# EAGLE design phasor (EAGLE 6.6.0)
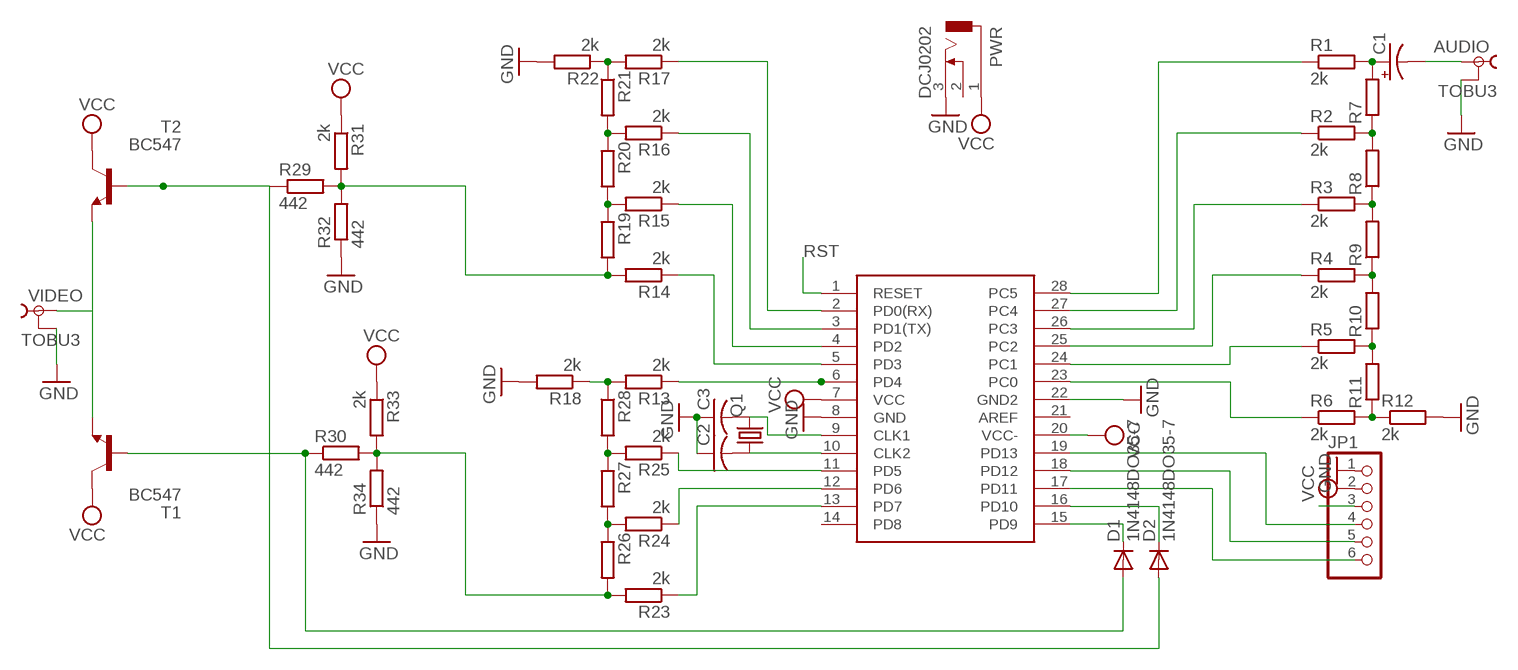
[diagram p0: schematic, sheet 1]

## Parts
AUDIO  TOBU3  [TOBU3]
C1  CPOL-USB45181A  [B45181A]
C2  C-US025-024X044  [C025-024X044]
C3  C-US025-024X044  [C025-024X044]
D1  1N4148DO35-7  [DO35-7]
D2  1N4148DO35-7  [DO35-7]
JP1  PINHD-1X6  [1X06]
PWR  DCJ0202  [DCJ0202]
Q1  CRYSTALHC49U70  [HC49U70]
R1  2k  R-EU_0207/10  [0207/10]
R2  2k  R-EU_0207/10  [0207/10]
R3  2k  R-EU_0207/10  [0207/10]
R4  2k  R-EU_0207/10  [0207/10]
R5  2k  R-EU_0207/10  [0207/10]
R6  2k  R-EU_0207/10  [0207/10]
R7  R-EU_0204/2V  [0204V]
R8  R-EU_0204/2V  [0204V]
R9  R-EU_0204/2V  [0204V]
R10  R-EU_0204/2V  [0204V]
R11  R-EU_0204/2V  [0204V]
R12  2k  R-EU_0207/10  [0207/10]
R13  2k  R-EU_0207/10  [0207/10]
R14  2k  R-EU_0207/10  [0207/10]
R15  2k  R-EU_0207/10  [0207/10]
R16  2k  R-EU_0207/10  [0207/10]
R17  2k  R-EU_0207/10  [0207/10]
R18  2k  R-EU_0207/10  [0207/10]
R19  R-EU_0204/2V  [0204V]
R20  R-EU_0204/2V  [0204V]
R21  R-EU_0204/2V  [0204V]
R22  2k  R-EU_0207/10  [0207/10]
R23  2k  R-EU_0207/10  [0207/10]
R24  2k  R-EU_0207/10  [0207/10]
R25  2k  R-EU_0207/10  [0207/10]
R26  R-EU_0204/2V  [0204V]
R27  R-EU_0204/2V  [0204V]
R28  R-EU_0204/2V  [0204V]
R29  442  R-EU_0204/5  [0204/5]
R30  442  R-EU_0204/2V  [0204V]
R31  2k  R-EU_0207/10  [0207/10]
R32  442  R-EU_0204/2V  [0204V]
R33  2k  R-EU_0207/10  [0207/10]
R34  442  R-EU_0204/2V  [0204V]
T1  BC547  [TO92]
T2  BC547  [TO92]
U$1  328P  [DIL28-3]
VIDEO  TOBU3  [TOBU3]

## Nets
GND: AUDIO.2 AUDIO.2@1 AUDIO.2@2 C2.1 C3.1 JP1.1 PWR.3 R12.2 R18.2 R22.2 R32.1 R34.1 U$1.8(GND) U$1.22(GND2) VIDEO.2 VIDEO.2@1 VIDEO.2@2
N$1: R1.1 U$1.28(PC5)
N$2: R2.1 U$1.27(PC4)
N$3: R3.1 U$1.26(PC3)
N$4: R4.1 U$1.25(PC2)
N$5: R5.1 U$1.24(PC1)
N$6: R6.1 U$1.23(PC0)
N$7: C1.+ R1.2 R7.2
N$8: R2.2 R7.1 R8.2
N$9: R3.2 R8.1 R9.2
N$10: R4.2 R9.1 R10.2
N$11: R5.2 R10.1 R11.2
N$12: R6.2 R11.1 R12.1
N$13: R17.1 U$1.2(PD0(RX))
N$14: R16.1 U$1.3(PD1(TX))
N$15: R15.1 U$1.4(PD2)
N$16: R14.1 U$1.5(PD3)
N$17: R13.1 U$1.6(PD4)
N$18: R13.2 R18.1 R28.1
N$19: R14.2 R19.2 R29.2 R31.2 R32.2
N$20: R15.2 R19.1 R20.2
N$21: R16.2 R20.1 R21.2
N$22: R17.2 R21.1 R22.1
N$23: R23.2 R26.2 R30.2 R33.2 R34.2
N$24: R24.2 R26.1 R27.2
N$25: R25.2 R27.1 R28.2
N$26: R25.1 U$1.11(PD5)
N$27: R24.1 U$1.12(PD6)
N$28: R23.1 U$1.13(PD7)
N$29: C2.2 Q1.1 U$1.10(CLK2)
N$30: C3.2 Q1.2 U$1.9(CLK1)
N$31: AUDIO.1 C1.-
N$32: D1.C U$1.15(PD9)
N$33: D2.C U$1.16(PD10)
N$34: T1.1(E) T2.1(E) VIDEO.1
N$35: D1.A R30.1 T1.2(B)
N$36: D2.A R29.1 T2.2(B)
N$37: JP1.4 U$1.19(PD13)
N$38: JP1.5 U$1.18(PD12)
N$39: JP1.6 U$1.17(PD11)
RST: JP1.3 U$1.1(RESET)
VCC: JP1.2 PWR.1 R31.1 R33.1 T1.3(C) T2.3(C) U$1.7(VCC) U$1.20(VCC-)
Unconnected: PWR.2 U$1.14(PD8) U$1.21(AREF)

## Library data of the parts
AUDIO VIDEO = con-hirschmann:TOBU3: Female Cinch CONNECTOR ( RCA Jack ); MF: FARNELL; MPN: TOBU 3; OC_FARNELL: 592791; OC_NEWARK: 06WX5914
C1 = resistor:CPOL-US: POLARIZED CAPACITOR, American symbol
C2 C3 = resistor:C-US: CAPACITOR, American symbol
D1 D2 = diode:1N4148: DIODE high speed (Philips)
JP1 = pinhead:PINHD-1X6: PIN HEADER
PWR = con-jack:DCJ0202: DC POWER JACK Source: DCJ0202.pdf; OC_FARNELL: unknown; OC_NEWARK: unknown
Q1 = crystal:CRYSTAL: CRYSTAL; OC_FARNELL: unknown; OC_NEWARK: unknown
R1-R34 = resistor:R-EU_: RESISTOR, European symbol
T1 T2 = transistor:BC547: NPN TRANSISTOR
U$1 = 328pp:328P

## Board
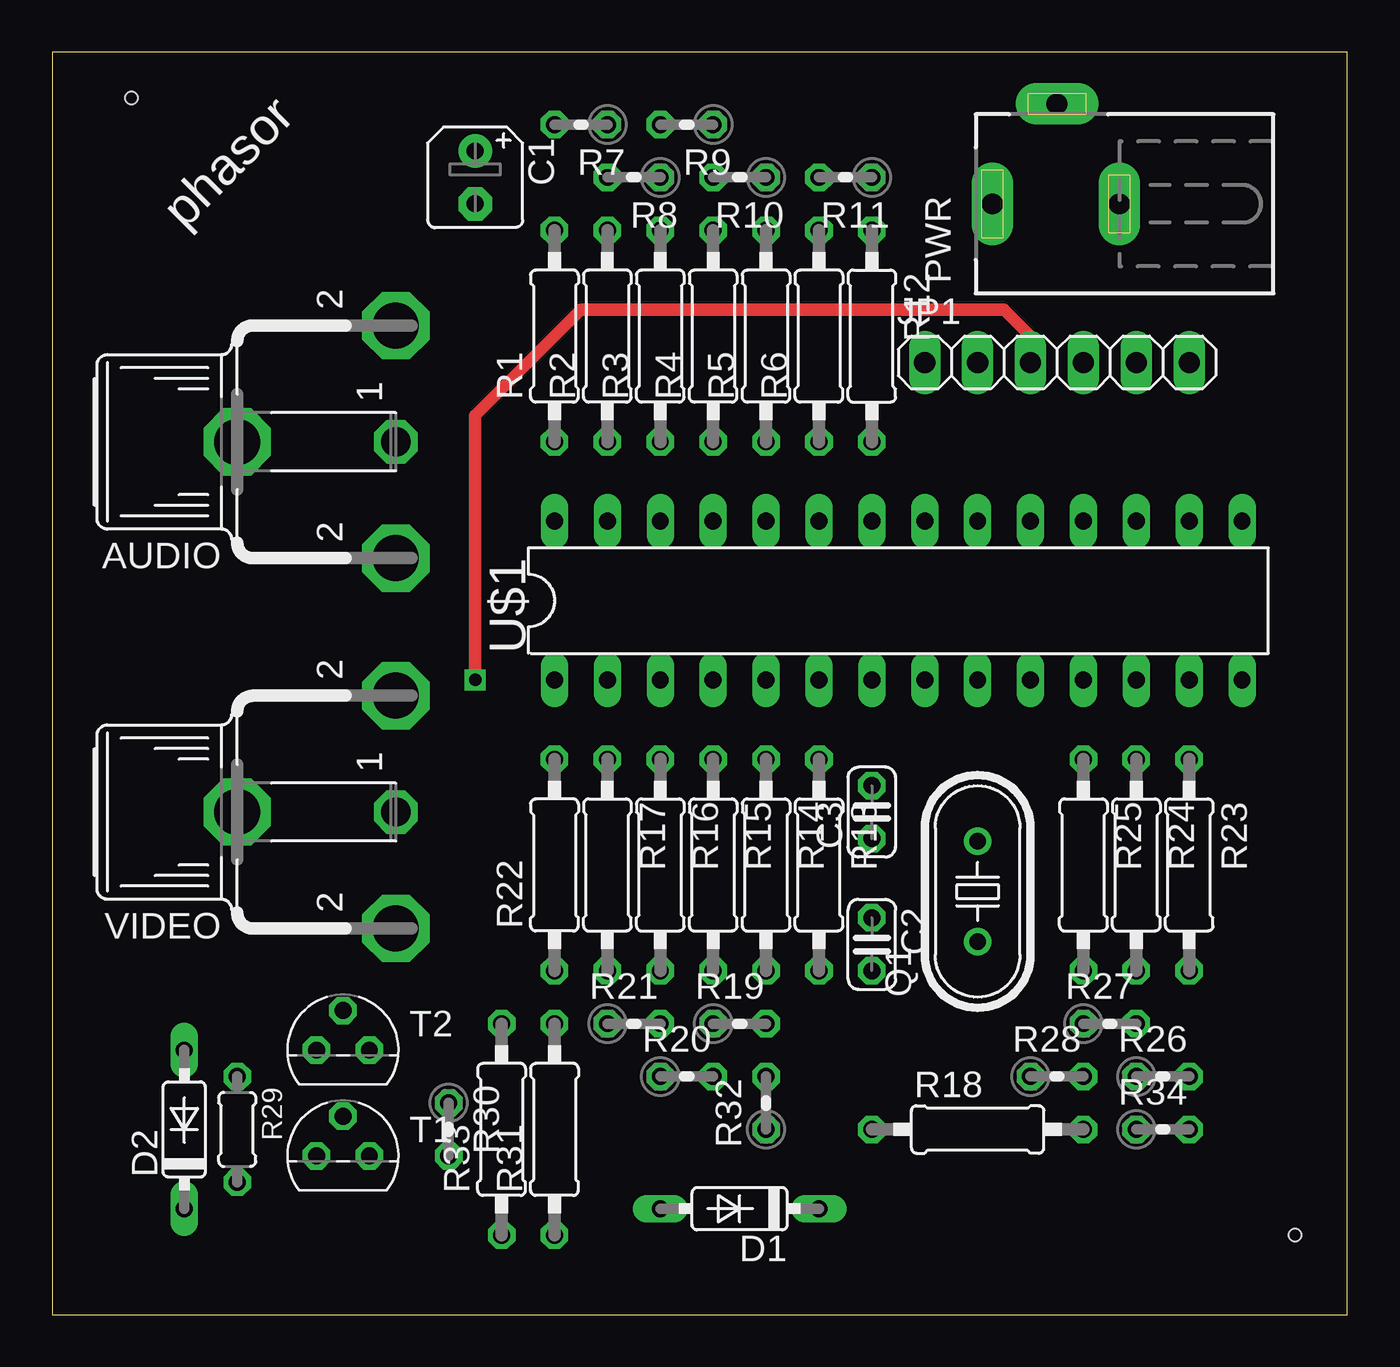
[diagram p1: board, top side]
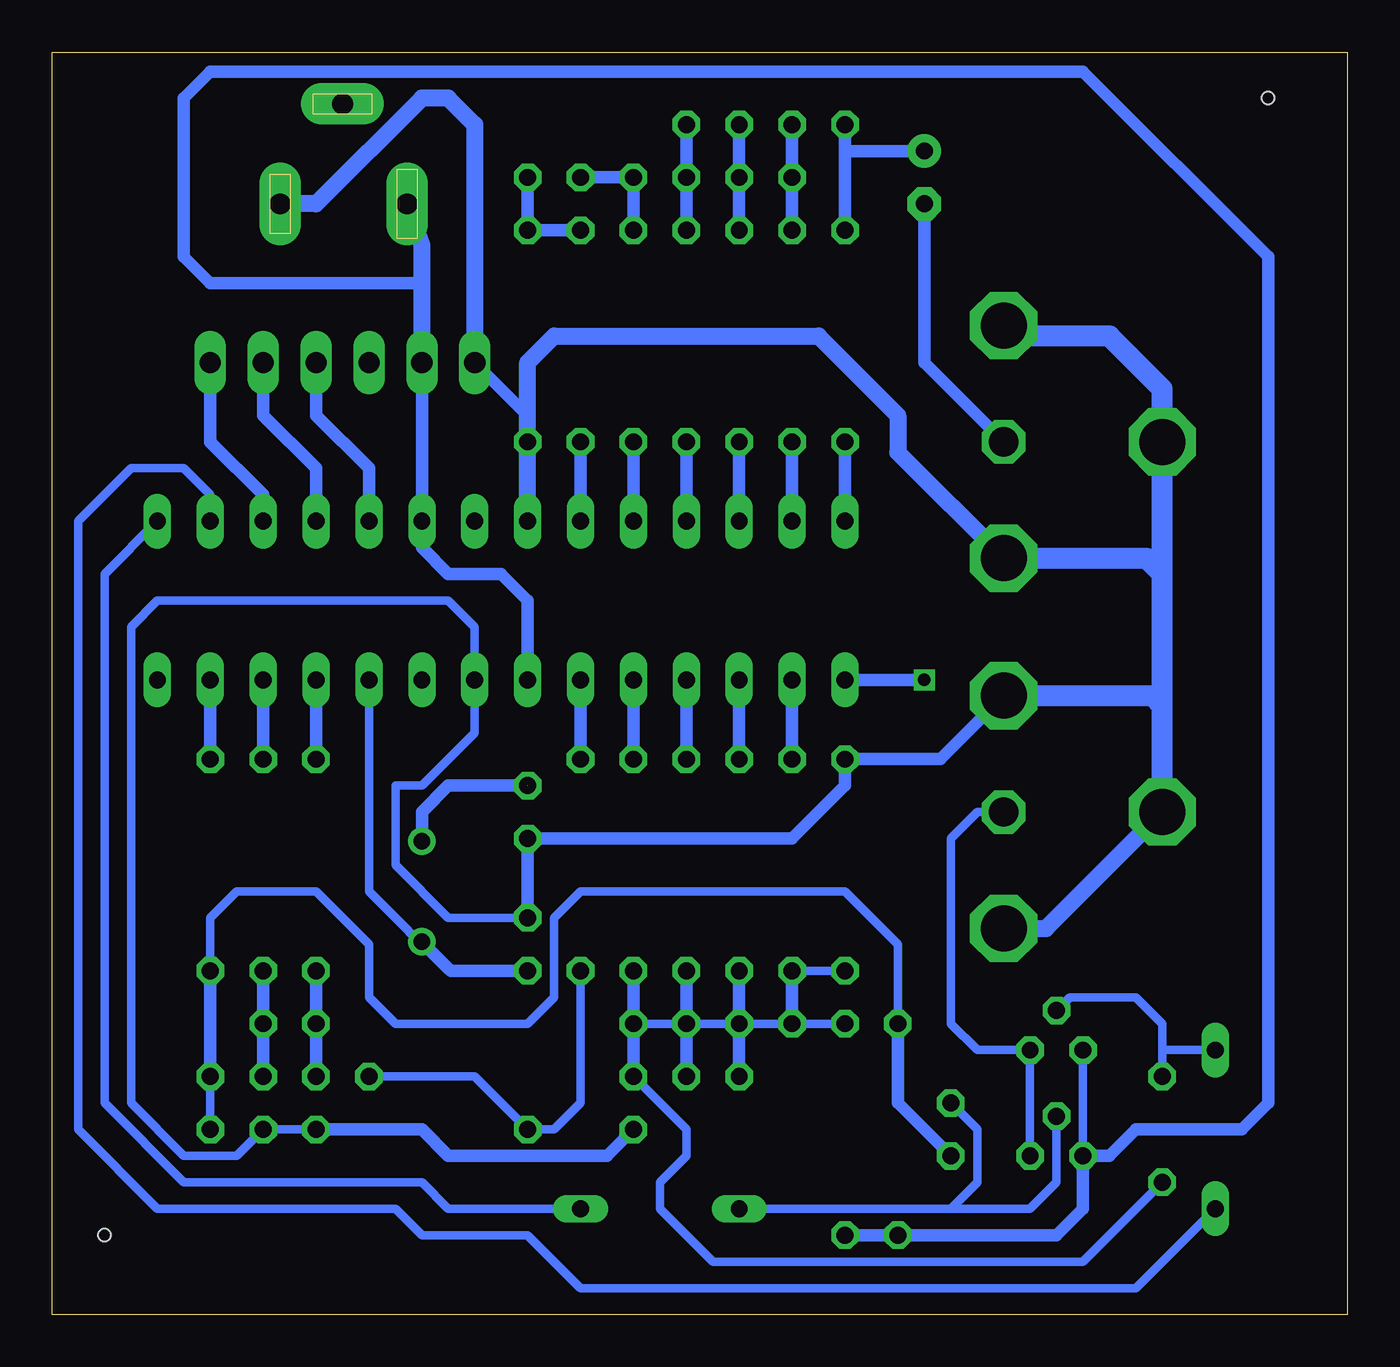
[diagram p2: board, bottom side, seen from below]

Size 62.21 x 60.63 mm. Coordinates in mm from the lower left corner, seen from the top.
Outline: 0,0 62.21,0 62.21,60.63 0,60.63 0,0
Copper layers (1*16): Top 0.035mm / dielectric 1.5mm / Bottom 0.035mm
Design rules "default": minimum track width 10mil, minimum drill 24mil, track to track 8mil, track to pad 8mil, pad to pad 8mil, via to via 8mil, smd to smd 8mil, copper to edge 40mil, drill to drill 8mil, minimum pad ring 10mil, minimum via ring 8mil, stop-mask expansion 4mil, vias tented up to drill 0mil, thermal gap 10mil
Holes 0.6 mm at 3.81,58.42 59.69,3.81

### Footprints (pad centres in the part's own frame; a part is rotated, then mirrored left to right if it is on the bottom)
TOBU3 = drill 1.397 octagon: 1 0,-2.54 | drill 2.21 octagon: 2 5.588,-2.54; 2@1 -5.588,-2.54; 2@2 0,5.08
B45181A = drill 0.813 pad 1.6: + -1.27,0 | drill 0.813 pad 1.6 octagon: - 1.27,0
C025-024X044 = drill 0.813 octagon: 1 -1.27,0; 2 1.27,0
DO35-7 = drill 0.813 long: A 3.81,0; C -3.81,0
1X06 = drill 1.016 long: 1 -6.35,0; 2 -3.81,0; 3 -1.27,0; 4 1.27,0; 5 3.81,0; 6 6.35,0
DCJ0202 = drill 1 pad 2 long: 1 0,3.1; 2 4.8,0; 3 0,-3
HC49U70 = drill 0.813: 1 -2.413,0; 2 2.413,0
0207/10 = drill 0.813 octagon: 1 -5.08,0; 2 5.08,0
0204V = drill 0.813 octagon: 1 -1.27,0; 2 1.27,0
0204/5 = drill 0.813 octagon: 1 -2.54,0; 2 2.54,0
TO92 = drill 0.813 octagon: 1 1.27,0; 2 0,1.905; 3 -1.27,0
DIL28-3 = drill 0.813 long: 1 -16.51,-3.81; 2 -13.97,-3.81; 3 -11.43,-3.81; 4 -8.89,-3.81; 5 -6.35,-3.81; 6 -3.81,-3.81; 7 -1.27,-3.81; 8 1.27,-3.81; 9 3.81,-3.81; 10 6.35,-3.81; 11 8.89,-3.81; 12 11.43,-3.81; 13 13.97,-3.81; 14 16.51,-3.81; 15 16.51,3.81; 16 13.97,3.81; 17 11.43,3.81; 18 8.89,3.81; 19 6.35,3.81; 20 3.81,3.81; 21 1.27,3.81; 22 -1.27,3.81; 23 -3.81,3.81; 24 -6.35,3.81; 25 -8.89,3.81; 26 -11.43,3.81; 27 -13.97,3.81; 28 -16.51,3.81

### Placement (x,y rotation side)
AUDIO  13.97,41.91 90 top
C1  20.32,54.61 270 top
C2  39.37,17.78 270 top
C3  39.37,24.13 90 top
D1  33.02,5.08 180 top
D2  6.35,8.89 90 top
JP1  48.26,45.72 0 top
PWR  48.26,53.34 90 top
Q1  44.45,20.32 90 top
R1  24.13,46.99 90 top
R2  26.67,46.99 90 top
R3  29.21,46.99 90 top
R4  31.75,46.99 90 top
R5  34.29,46.99 90 top
R6  36.83,46.99 90 top
R7  25.4,57.15 180 top
R8  27.94,54.61 180 top
R9  30.48,57.15 180 top
R10  33.02,54.61 180 top
R11  38.1,54.61 180 top
R12  39.37,46.99 270 top
R13  36.83,21.59 270 top
R14  34.29,21.59 270 top
R15  31.75,21.59 270 top
R16  29.21,21.59 270 top
R17  26.67,21.59 270 top
R18  44.45,8.89 0 top
R19  33.02,13.97 0 top
R20  30.48,11.43 0 top
R21  27.94,13.97 0 top
R22  24.13,21.59 90 top
R23  54.61,21.59 270 top
R24  52.07,21.59 270 top
R25  49.53,21.59 270 top
R26  53.34,11.43 0 top
R27  50.8,13.97 0 top
R28  48.26,11.43 0 top
R29  8.89,8.89 270 top
R30  19.05,8.89 270 top
R31  24.13,8.89 90 top
R32  34.29,10.16 90 top
R33  21.59,8.89 90 top
R34  53.34,8.89 0 top
T1  13.97,7.62 0 top
T2  13.97,12.7 0 top
U$1  40.64,34.29 0 top
VIDEO  13.97,24.13 90 top

### Tracks (layer width: path | path; a pad name or v marks a point on that pad's centre or on a via)
GND
  Bottom 0.406: C2.1 43.18,19.05 45.72,21.59 45.72,25.4 44.45,25.4 41.91,27.94 U$1.8 41.91,33.02 43.18,34.29 57.15,34.29 58.42,33.02 58.42,10.16 55.88,7.62 53.34,7.62 R34.1 R18.2
  Bottom 0.61: C2.1 C3.1 26.67,22.86 24.13,25.4 R22.2 19.56,26.67 VIDEO.2 | U$1.22 R12.2 39.37,43.18 JP1.1 | R18.2 44.45,8.89 43.18,7.62 35.56,7.62 R32.1
  Bottom 0.813: 50.8,53.34 PWR.3 49.53,53.34 44.45,58.42 43.18,58.42 41.91,57.15 JP1.1 | VIDEO.2@1 14.48,18.54 VIDEO.2@2 | U$1.22 39.37,45.72 38.1,46.99 25.4,46.99 21.59,43.18 21.59,41.4 AUDIO.2@1
  Bottom 1.016: VIDEO.2@2 8.89,29.21 | 8.89,29.21 8.89,35.56 | 8.89,35.56 AUDIO.2@2 8.89,44.45 11.43,46.99 16,46.99 AUDIO.2 | AUDIO.2@1 9.65,36.32 8.89,35.56 | VIDEO.2 9.4,29.72 8.89,29.21
N$1
  Bottom 0.61: U$1.28 R1.1
N$2
  Bottom 0.61: U$1.27 R2.1
N$3
  Bottom 0.61: U$1.26 R3.1
N$4
  Bottom 0.61: U$1.25 R4.1
N$5
  Bottom 0.61: U$1.24 R5.1
N$6
  Bottom 0.61: U$1.23 R6.1
N$7
  Bottom 0.61: R1.2 24.13,55.88 | 24.13,55.88 R7.2 | C1.+ 24.13,55.88
N$8
  Bottom 0.61: R2.2 R8.2 R7.1
N$9
  Bottom 0.61: R3.2 R8.1 R9.2
N$10
  Bottom 0.61: R4.2 R10.2 R9.1
N$11
  Bottom 0.61: R5.2 R10.1 R11.2
N$12
  Bottom 0.61: R6.2 R12.1 R11.1
N$13
  Bottom 0.61: R17.1 U$1.2
N$14
  Bottom 0.61: R16.1 U$1.3
N$15
  Bottom 0.61: R15.1 U$1.4
N$16
  Bottom 0.61: R14.1 U$1.5
N$17
  Bottom 0.61: R13.1 U$1.6
N$18
  Bottom 0.406: R28.1 41.91,11.43 R18.1 38.1,8.89 36.83,10.16 R13.2
N$19
  Bottom 0.406: R31.2 R19.2 | R32.2 31.75,8.89 31.75,7.62 33.02,6.35 33.02,5.08 30.48,2.54 12.7,2.54 R29.2
  Bottom 0.61: R14.2 R19.2 R32.2
N$20
  Bottom 0.61: R20.2 R19.1 R15.2
N$21
  Bottom 0.61: R20.1 R21.2 R16.2
N$22
  Bottom 0.406: R17.2 R22.1
  Bottom 0.61: R21.1 R17.2
N$23
  Bottom 0.406: R34.2 R26.2 | R33.2 21.59,17.78 24.13,20.32 36.83,20.32 38.1,19.05 38.1,15.24 39.37,13.97 45.72,13.97 46.99,15.24 46.99,17.78 49.53,20.32 53.34,20.32 54.61,19.05 R23.2
  Bottom 0.61: R30.2 21.59,10.16 R33.2 | R26.2 R23.2
N$24
  Bottom 0.61: R24.2 R27.2 R26.1
N$25
  Bottom 0.61: R25.2 R27.1 R28.2
N$26
  Bottom 0.61: R25.1 U$1.11
N$27
  Bottom 0.61: R24.1 U$1.12
N$28
  Bottom 0.61: R23.1 U$1.13
N$29
  Bottom 0.406: C2.2 43.18,16.51 46.99,20.32 U$1.10
  Bottom 0.61: C2.2 43.05,16.51 Q1.1
N$30  (1 unrouted)
  Bottom 0.61: Q1.2 44.45,24.13 43.18,25.4 C3.2
N$31
  Bottom 0.61: AUDIO.1 20.32,45.72 C1.-
N$32
  Bottom 0.406: U$1.15 59.69,35.56 59.69,10.16 55.88,6.35 44.45,6.35 43.18,5.08 D1.C
N$33
  Bottom 0.406: U$1.16 54.61,39.37 55.88,40.64 58.42,40.64 60.96,38.1 60.96,8.89 57.15,5.08 45.72,5.08 44.45,3.81 39.37,3.81 36.83,1.27 10.16,1.27 D2.C
N$34
  Bottom 0.406: T1.1 T2.1 17.78,12.7 19.05,13.97 19.05,22.86 17.78,24.13 VIDEO.1
N$35
  Bottom 0.406: D1.A 19.05,5.08 | 19.05,5.08 17.78,6.35 17.78,8.89 R30.1 | T1.2 13.97,6.35 15.24,5.08 19.05,5.08
N$36
  Bottom 0.406: R29.1 8.89,12.7 | 8.89,12.7 8.89,13.97 10.16,15.24 13.34,15.24 T2.2 | D2.A 8.89,12.7
N$37
  Bottom 0.61: U$1.19 46.99,40.64 49.53,43.18 JP1.4
N$38
  Bottom 0.61: U$1.18 49.53,40.64 52.07,43.18 JP1.5
N$39
  Bottom 0.61: U$1.17 52.07,39.37 54.61,41.91 JP1.6
RST  (via drill 0.6)
  Top 0.61: v20.32,30.48 20.32,43.18 25.4,48.26 45.72,48.26 46.99,46.99 JP1.3
  Bottom 0.61: U$1.1 v20.32,30.48
VCC
  Bottom 0.406: T1.3 T2.3 | R33.1 13.97,3.81
  Bottom 0.61: JP1.2 U$1.20 44.45,36.83 43.18,35.56 40.64,35.56 39.37,34.29 U$1.7 | R33.1 R31.1 13.97,3.81 12.7,5.08 T1.3 11.43,7.62 10.16,8.89 5.08,8.89 3.81,10.16 3.81,50.8 12.7,59.69 54.61,59.69 55.88,58.42 55.88,50.8 54.61,49.53 44.45,49.53
  Bottom 0.813: JP1.2 44.45,49.53 44.45,51.36 PWR.1

### Text on the board
tNames: phasor